# Altium schematic sheet servo_power.SchDoc
size A4
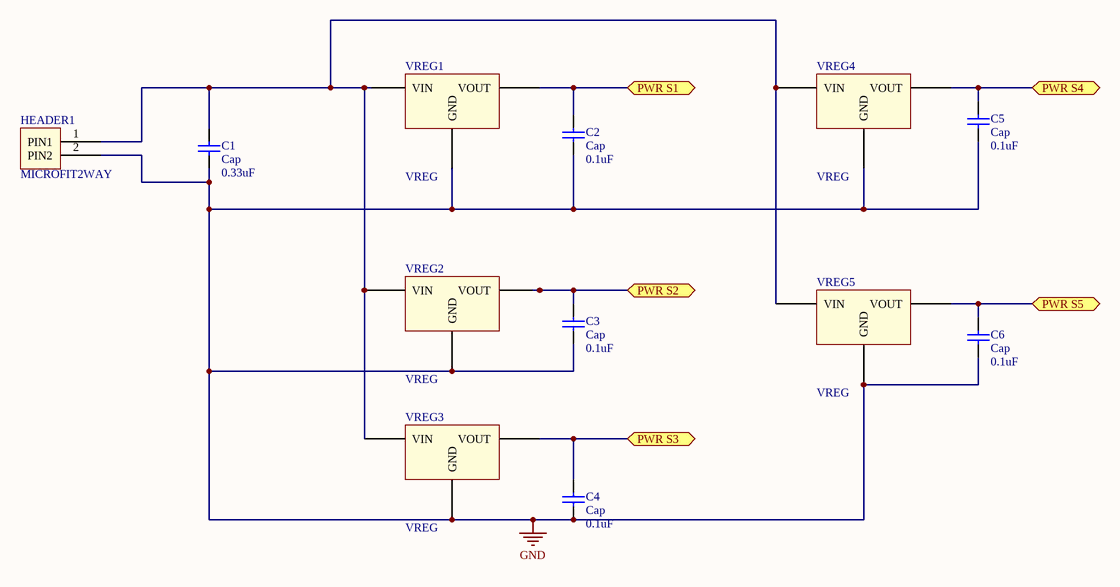
[diagram p0: servo_power.SchDoc]

## Parts
C1  Cap  value 0.33uF  [RAD-0.3]
C2  Cap  value 0.1uF  [RAD-0.3]
C3  Cap  value 0.1uF  [RAD-0.3]
C4  Cap  value 0.1uF  [RAD-0.3]
C5  Cap  value 0.1uF  [RAD-0.3]
C6  Cap  value 0.1uF  [RAD-0.3]
HEADER1  MICROFIT2WAY  [MICROFIT2WAY]
VREG1  VREG  [TO-220 VREG]
VREG2  VREG  [TO-220 VREG]
VREG3  VREG  [TO-220 VREG]
VREG4  VREG  [TO-220 VREG]
VREG5  VREG  [TO-220 VREG]

## Ports
PWR S1, PWR S2, PWR S3, PWR S4, PWR S5

## Nets
GND: C1.1 C2.1 C3.1 C4.1 C5.1 C6.1 HEADER1.2(PIN2) VREG1.2(GND) VREG2.2(GND) VREG3.2(GND) VREG4.2(GND) VREG5.2(GND)
PWR S1: C2.2 VREG1.3(VOUT) ; port PWR S1
PWR S2: C3.2 VREG2.3(VOUT) ; port PWR S2
PWR S3: C4.2 VREG3.3(VOUT) ; port PWR S3
PWR S4: C5.2 VREG4.3(VOUT) ; port PWR S4
PWR S5: C6.2 VREG5.3(VOUT) ; port PWR S5
NetC1_2: C1.2 HEADER1.1(PIN1) VREG1.1(VIN) VREG2.1(VIN) VREG3.1(VIN) VREG4.1(VIN) VREG5.1(VIN)

## Library data of the parts
C1-C6 = Cap: Capacitor; Published: 8-Jun-2000; LatestRevisionDate: 17-Jul-2002; LatestRevisionNote: Re-released for DXP Platform.; PackageReference: RAD-0.3; Publisher: Altium Limited; PackageDescription: Radial Cap, Thru-Hole; 2 Leads; 0.3 in Pin Spacing
HEADER1 = MICROFIT2WAY HEADER
VREG1-VREG5 = VOLTAGE REGULATOR